# EAGLE design BalancedInputOutput (EAGLE 6.6.0)
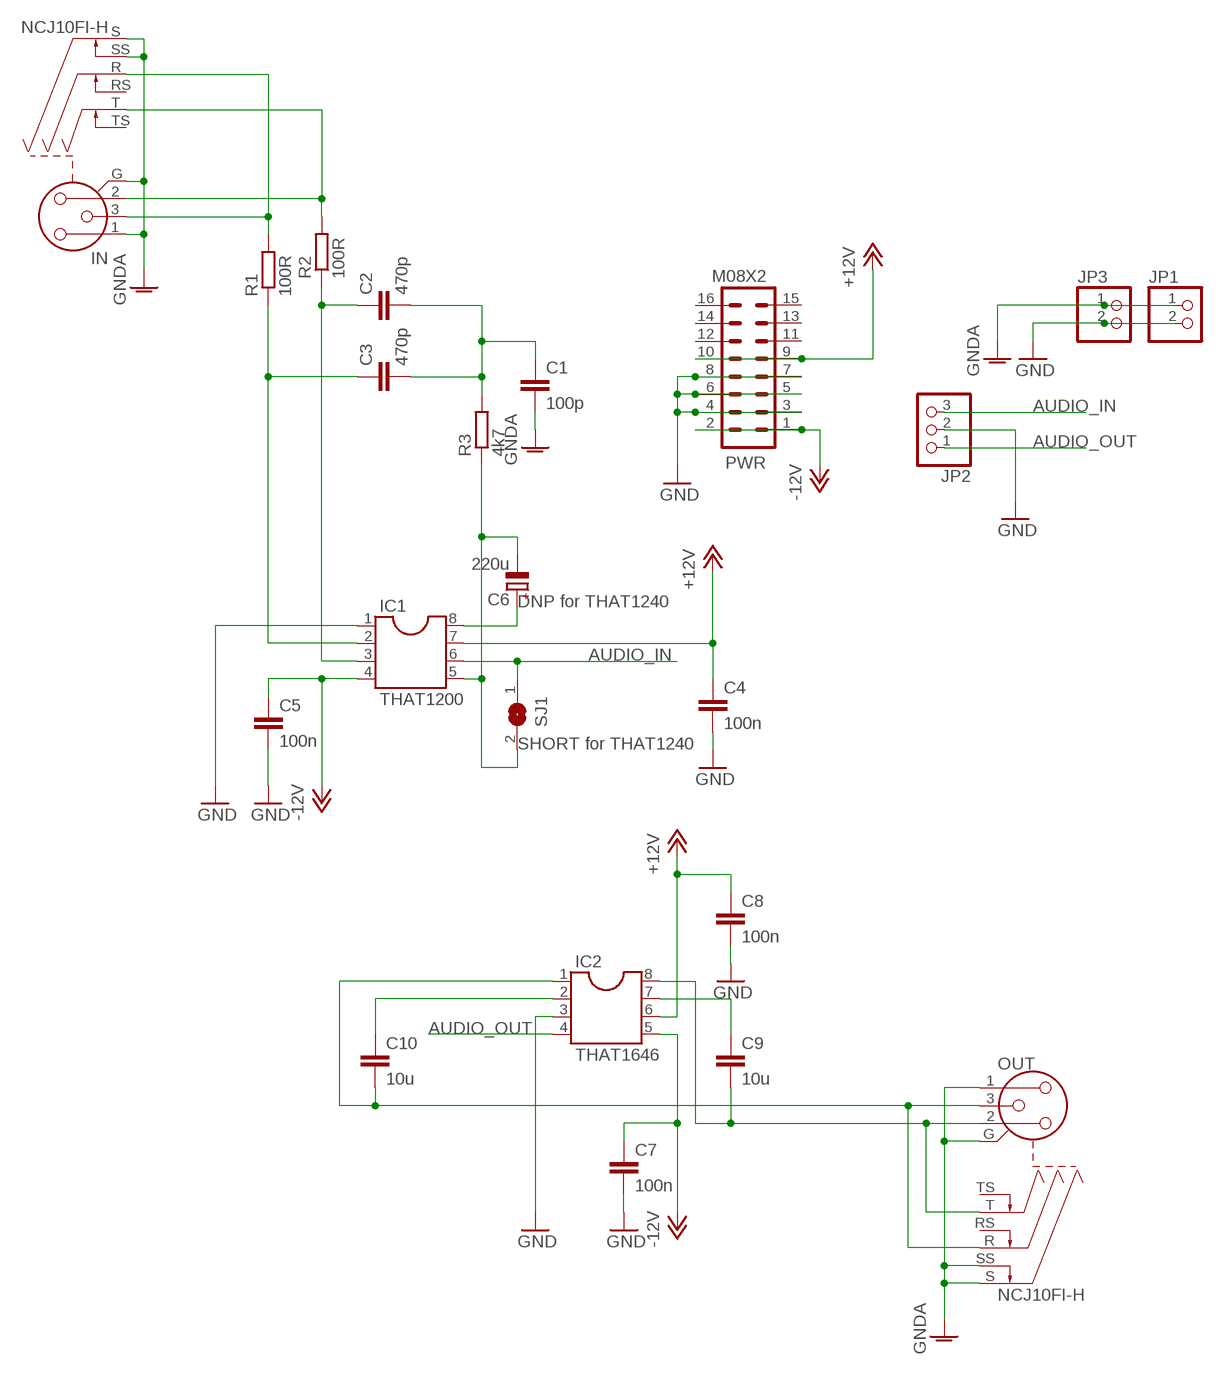
[diagram p0: schematic, sheet 1]

## Parts
C1  100p  C-EU050-025X075  [C050-025X075]
C2  470p  C-EU050-025X075  [C050-025X075]
C3  470p  C-EU050-025X075  [C050-025X075]
C4  100n  C-EU050-025X075  [C050-025X075]
C5  100n  C-EU050-025X075  [C050-025X075]
C6  220u  CPOL-EUE5-8.5  [E5-8,5]
C7  100n  C-EU050-025X075  [C050-025X075]
C8  100n  C-EU050-025X075  [C050-025X075]
C9  10u  C-EU050-025X075  [C050-025X075]
C10  10u  C-EU050-025X075  [C050-025X075]
IC1  THAT1200  DIL8  [DIL08]
IC2  THAT1646  DIL8  [DIL08]
IN  NCJ10FI-H  [NCJ10FI-H]
JP1  PINHD-1X2  [1X02]
JP2  PINHD-1X3  [1X03]
JP3  PINHD-1X2  [1X02]
OUT  NCJ10FI-H  [NCJ10FI-H]
PWR  M08X2  [2X8]
R1  100R  R-EU_0207/7  [0207/7]
R2  100R  R-EU_0207/7  [0207/7]
R3  4k7  R-EU_0207/7  [0207/7]
SJ1  SJW  [SJW]

## Nets
+12V: C4.1 C8.1 IC1.7 IC2.6 PWR.9 PWR.10
-12V: C5.1 C7.1 IC1.4 IC2.5 PWR.1 PWR.2
AUDIO_IN: IC1.6 JP2.3 SJ1.1
AUDIO_OUT: IC2.4 JP2.1
GND: C4.2 C5.2 C7.2 C8.2 IC1.1 IC2.3 JP1.2 JP2.2 JP3.2 PWR.3 PWR.4 PWR.5 PWR.6 PWR.7 PWR.8
GNDA: C1.2 IN.1 IN.G IN.S IN.SS JP1.1 JP3.1 OUT.1 OUT.G OUT.S OUT.SS
N$1: C3.1 IC1.2 R1.1
N$3: IN.3 IN.R R1.2
N$4: C2.1 IC1.3 R2.1
N$5: IN.2 IN.T R2.2
N$6: C6.- IC1.5 R3.1 SJ1.2
N$7: C1.1 C2.2 C3.2 R3.2
N$8: C9.1 IC2.7
N$10: C10.1 IC2.2
N$13: C6.+ IC1.8
N$18: C9.2 IC2.8 OUT.2 OUT.T
N$19: C10.2 IC2.1 OUT.3 OUT.R
Unconnected: IN.RS IN.TS OUT.RS OUT.TS PWR.11 PWR.12 PWR.13 PWR.14 PWR.15 PWR.16

## Notes on the sheet
- DNP for THAT1240
- SHORT for THAT1240

## Library data of the parts
C1-C5 C7-C10 = rcl:C-EU: CAPACITOR, European symbol
C6 = rcl:CPOL-EU: POLARIZED CAPACITOR, European symbol
IC1 IC2 = ic-package:DIL8: Dual In Line / Socket
IN OUT = con-neutrik_ag:NCJ10FI-: Neutrik Audio Connector XLR SERIES Stereo 1/4" jack with switch Source: www.neutrik.com/; OC_FARNELL: unknown; OC_NEWARK: unknown
JP1 JP3 = pinhead:PINHD-1X2: PIN HEADER
JP2 = pinhead:PINHD-1X3: PIN HEADER
PWR = SparkFun:M08X2
R1-R3 = rcl:R-EU_: RESISTOR, European symbol
SJ1 = jumper:SJ: SMD solder JUMPER

## Board
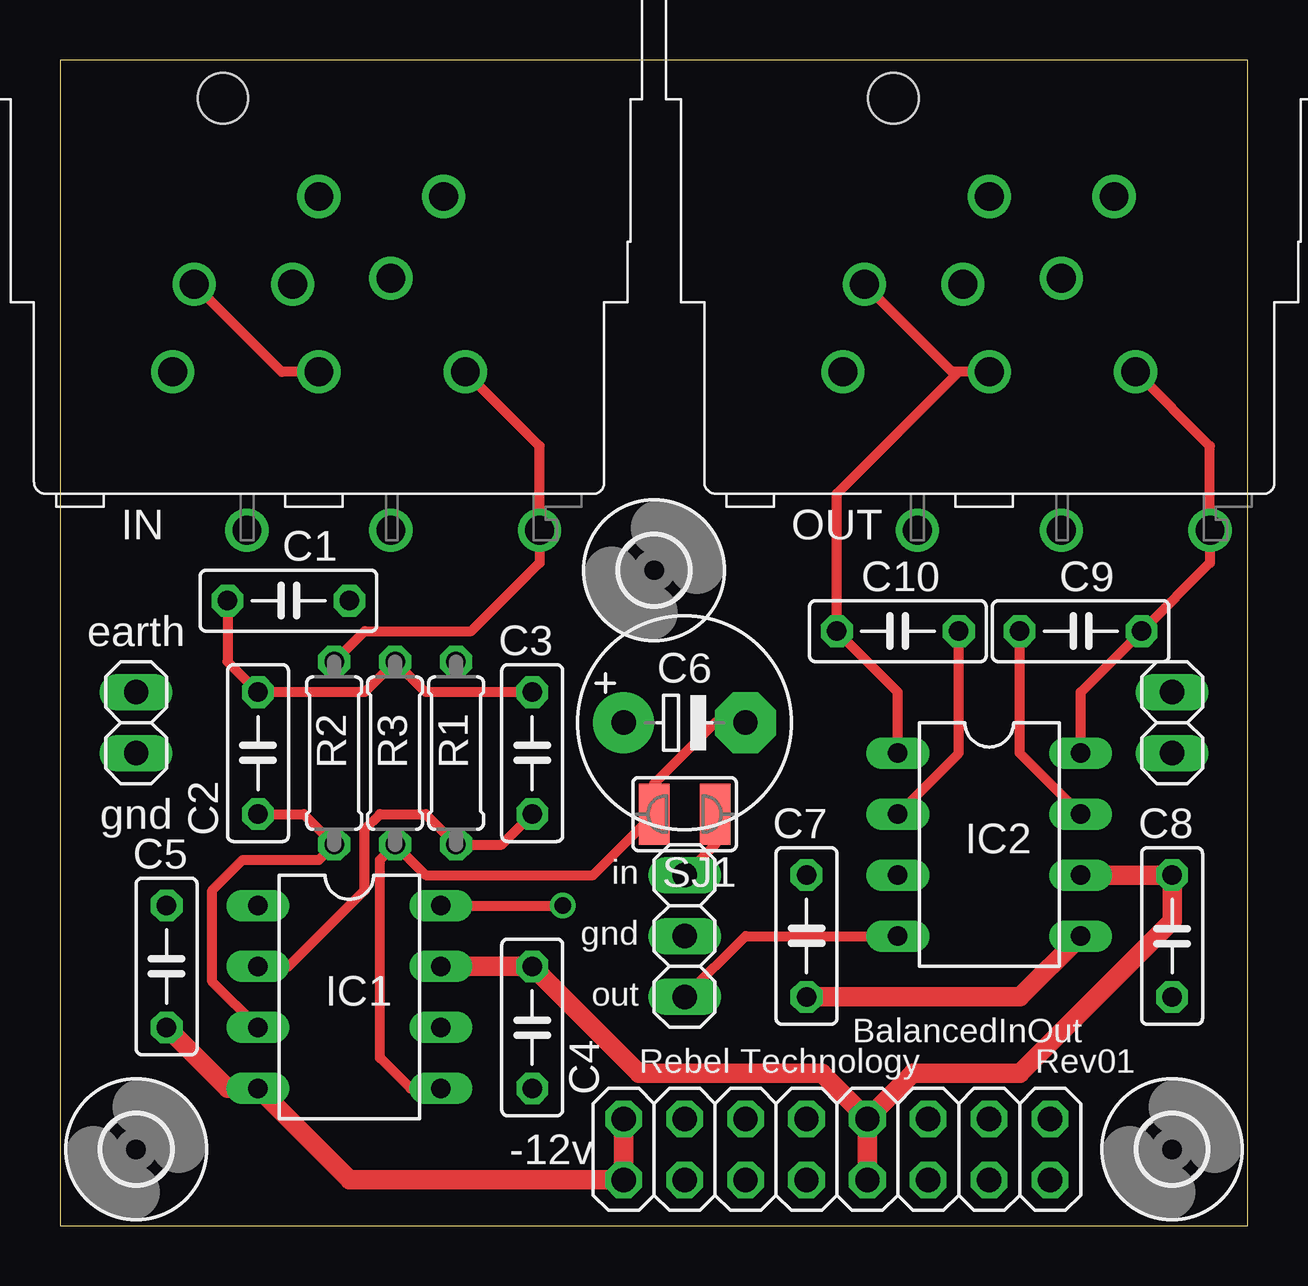
[diagram p1: board, top side]
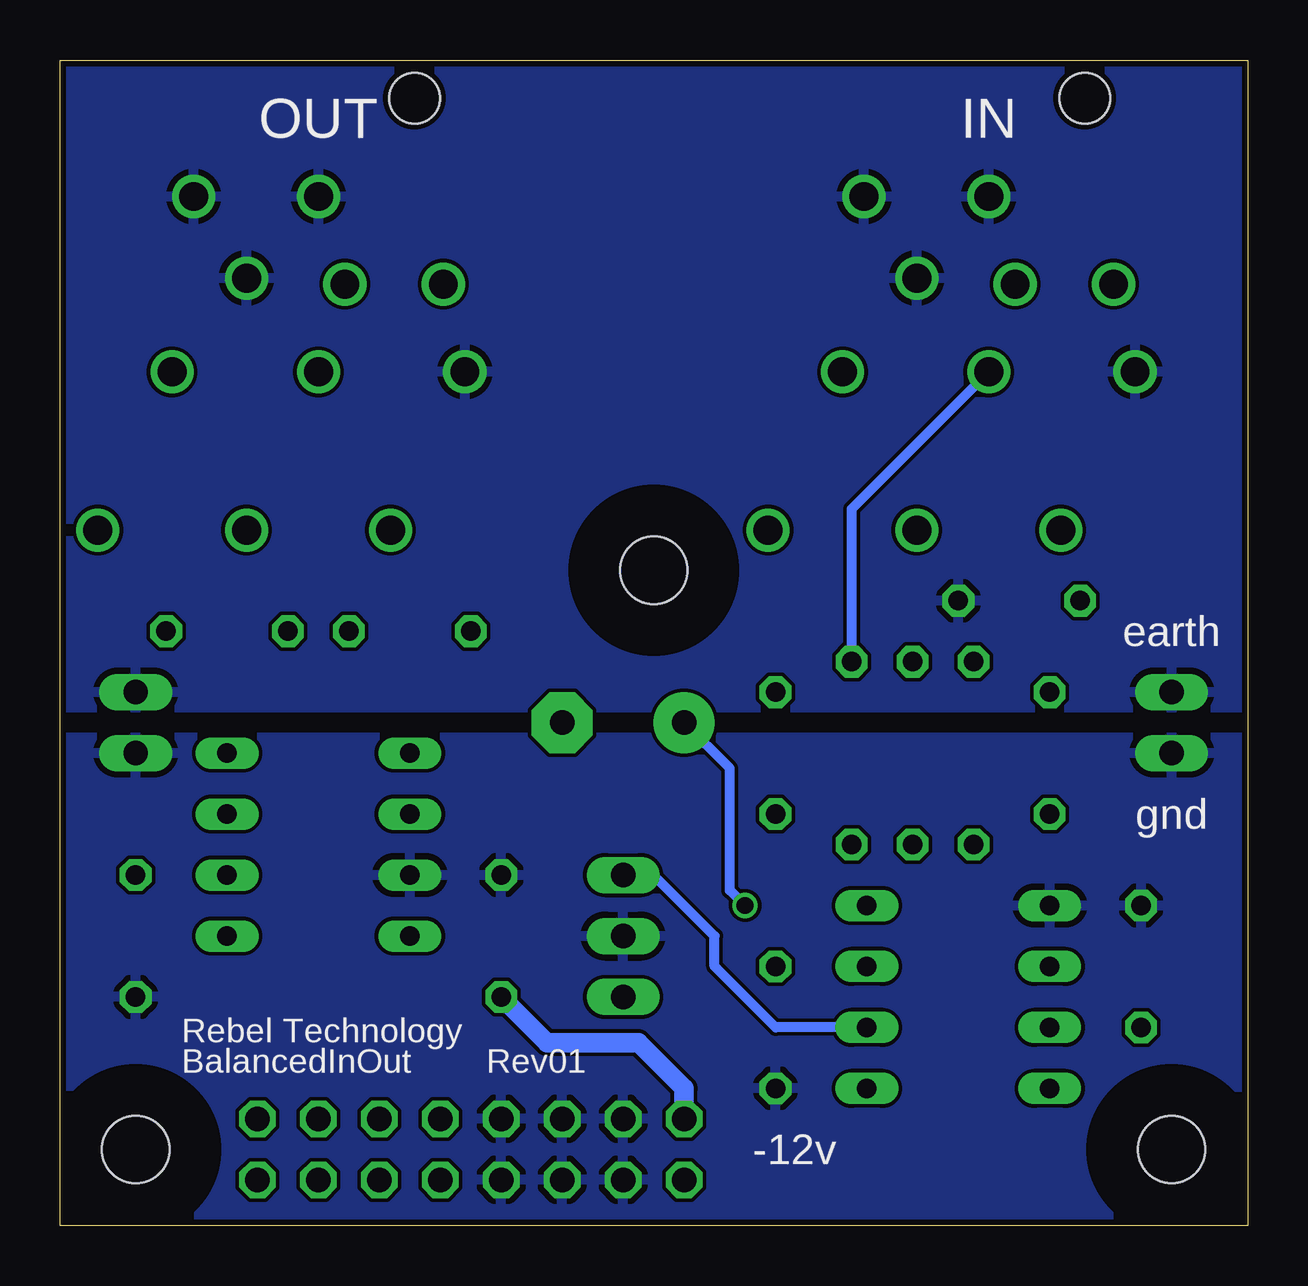
[diagram p2: board, bottom side, seen from below]

Size 49.51 x 48.57 mm. Coordinates in mm from the lower left corner, seen from the top.
Outline: 0,0 49.51,0 49.51,48.57 0,48.57 0,0
Copper layers (1*16): Top 0.035mm / dielectric 1.5mm / Bottom 0.035mm
Design rules "Fusion_eagle_rule_v1.1": minimum track width 6mil, minimum drill 12mil, track to track 6mil, track to pad 6mil, pad to pad 6mil, via to via 6mil, smd to smd 0mil, copper to edge 10mil, drill to drill 10mil, minimum pad ring 10mil, minimum via ring 6mil, stop-mask expansion 2mil, vias tented up to drill 100mil, thermal gap 10mil

### Footprints (pad centres in the part's own frame; a part is rotated, then mirrored left to right if it is on the bottom)
C050-025X075 = drill 0.813 octagon: 1 -2.54,0; 2 2.54,0
E5-8,5 = drill 1.016 pad 2.54: + -2.54,0 | drill 1.016 pad 2.54 octagon: - 2.54,0
DIL08 = drill 0.813 long: 1 -3.81,-3.81; 2 -1.27,-3.81; 3 1.27,-3.81; 4 3.81,-3.81; 5 3.81,3.81; 6 1.27,3.81; 7 -1.27,3.81; 8 -3.81,3.81
NCJ10FI-H = drill 1.2: 1 -6.1,-18.4; 2 6.1,-18.4; 3 0,-18.4; G 0,-11.1; GN -1.1,-14.75; R -5.2,-14.75; RS -3,-25; S 5.2,-11.1; SS 3,-14.5; T 9.2,-25; TS 3,-25 | hole 2.1: -4,-7
1X02 = drill 1.016 long: 1 -1.27,0; 2 1.27,0
1X03 = drill 1.016 long: 1 -2.54,0; 2 0,0; 3 2.54,0
2X8 = drill 1.016 octagon: 1 0,0; 2 0,2.54; 3 2.54,0; 4 2.54,2.54; 5 5.08,0; 6 5.08,2.54; 7 7.62,0; 8 7.62,2.54; 9 10.16,0; 10 10.16,2.54; 11 12.7,0; 12 12.7,2.54; 13 15.24,0; 14 15.24,2.54; 15 17.78,0; 16 17.78,2.54
0207/7 = drill 0.813 octagon: 1 -3.81,0; 2 3.81,0
SJW = smd 1.27 x 2.54: 1 -1.27,0; 2 1.27,0
2,8 = hole 2.8: 0,0

### Placement (x,y rotation side)
C1  9.53,26.04 0 top
C2  8.26,19.68 90 top
C3  19.68,19.68 90 top
C4  19.68,8.26 270 top
C5  4.45,10.8 90 top
C6  26.04,20.96 0 top
C7  31.11,12.06 90 top
C8  46.36,12.06 270 top
C9  42.55,24.77 0 top
C10  34.93,24.77 180 top
IC1  12.06,9.52 270 top
IC2  38.73,15.88 270 top
IN  10.79,53.98 0 top
JP1  3.17,20.96 270 top
JP2  26.04,12.06 90 top
JP3  46.36,20.96 270 top
OUT  38.73,53.98 0 top
PWR  23.49,1.91 0 top
R1  16.51,19.68 90 top
R2  11.43,19.68 90 top
R3  13.97,19.68 90 top
SJ1  26.04,17.15 180 top
U$1  [2,8]  3.17,3.18 0 top
U$2  [2,8]  46.36,3.18 0 top
U$3  [2,8]  24.76,27.3 0 top

### Tracks (layer width: path | path; a pad name or v marks a point on that pad's centre or on a via)
+12V
  Top 0.813: IC1.7 C4.1 24.13,6.35 31.75,6.35 PWR.10 | PWR.10 35.56,6.35 40.01,6.35 46.36,12.7 C8.1 IC2.6 | PWR.9 PWR.10
-12V
  Top 0.813: C5.1 6.99,5.72 IC1.4 12.06,1.91 PWR.1 PWR.2 | IC2.5 40.01,9.52 C7.1
  Bottom 0.813: PWR.2 23.49,5.72 25.4,7.62 29.21,7.62 C7.1
AUDIO_IN
  Top 0.406: SJ1.1 27.3,15.88 JP2.3
  Bottom 0.406: IC1.6 19.68,8.26 22.22,10.8 22.22,12.06 24.76,14.6 JP2.3
AUDIO_OUT
  Top 0.406: JP2.1 28.57,12.06 IC2.4
GND
  pour Bottom: -4.45,20.32 59.05,20.32 59.05,-3.17 -4.45,-3.17
GNDA
  pour Bottom: -4.45,21.59 -4.45,51.43 59.05,51.43 59.05,21.59
N$1
  Top 0.406: C3.1 18.41,15.88 R1.1 15.24,17.15 13.34,17.15 12.7,16.51 12.7,13.97 9.53,10.8 IC1.2
N$3
  Top 0.406: IN.3 9.25,35.57 IN.R
  Bottom 0.406: R1.2 16.51,29.86 IN.3
N$4
  Top 0.406: IC1.3 6.35,10.16 6.35,13.97 7.62,15.24 10.79,15.24 R2.1 10.16,17.15 C2.1
N$5
  Top 0.406: IN.2 19.99,32.48 IN.T 19.99,27.62 17.14,24.77 12.7,24.77 R2.2
N$6
  Top 0.406: IC1.5 14.61,5.72 13.34,6.98 13.34,15.24 R3.1 15.24,14.6 22.22,14.6 SJ1.2 24.76,18.41 27.3,20.96 C6.-
N$7
  Top 0.406: C3.2 15.24,22.23 R3.2 12.7,22.23 C2.2 6.99,23.49 C1.1
N$8
  Top 0.406: IC2.7 40.01,19.68 C9.1
N$10
  Top 0.406: IC2.2 37.47,19.68 C10.1
N$13  (via drill 0.7)
  Top 0.406: IC1.8 v20.95,13.34
  Bottom 0.406: v20.95,13.34 21.59,13.97 21.59,19.05 C6.+
N$18
  Top 0.406: OUT.2 47.94,32.48 OUT.T 47.94,27.62 C9.2 42.55,22.23 IC2.8
N$19
  Top 0.406: OUT.3 37.47,35.57 | 37.47,35.57 37.19,35.57 OUT.R | 37.47,35.57 32.39,30.49 C10.2 34.93,22.23 IC2.1

### Text on the board
tPlace: earth | gnd | in | gnd | out | BalancedInOut | Rebel Technology | Rev01 | -12v
bPlace: IN | OUT | earth | gnd | Rebel Technology | Rev01 | BalancedInOut | -12v